# Altium schematic sheet Sheet1.SchDoc
size A2
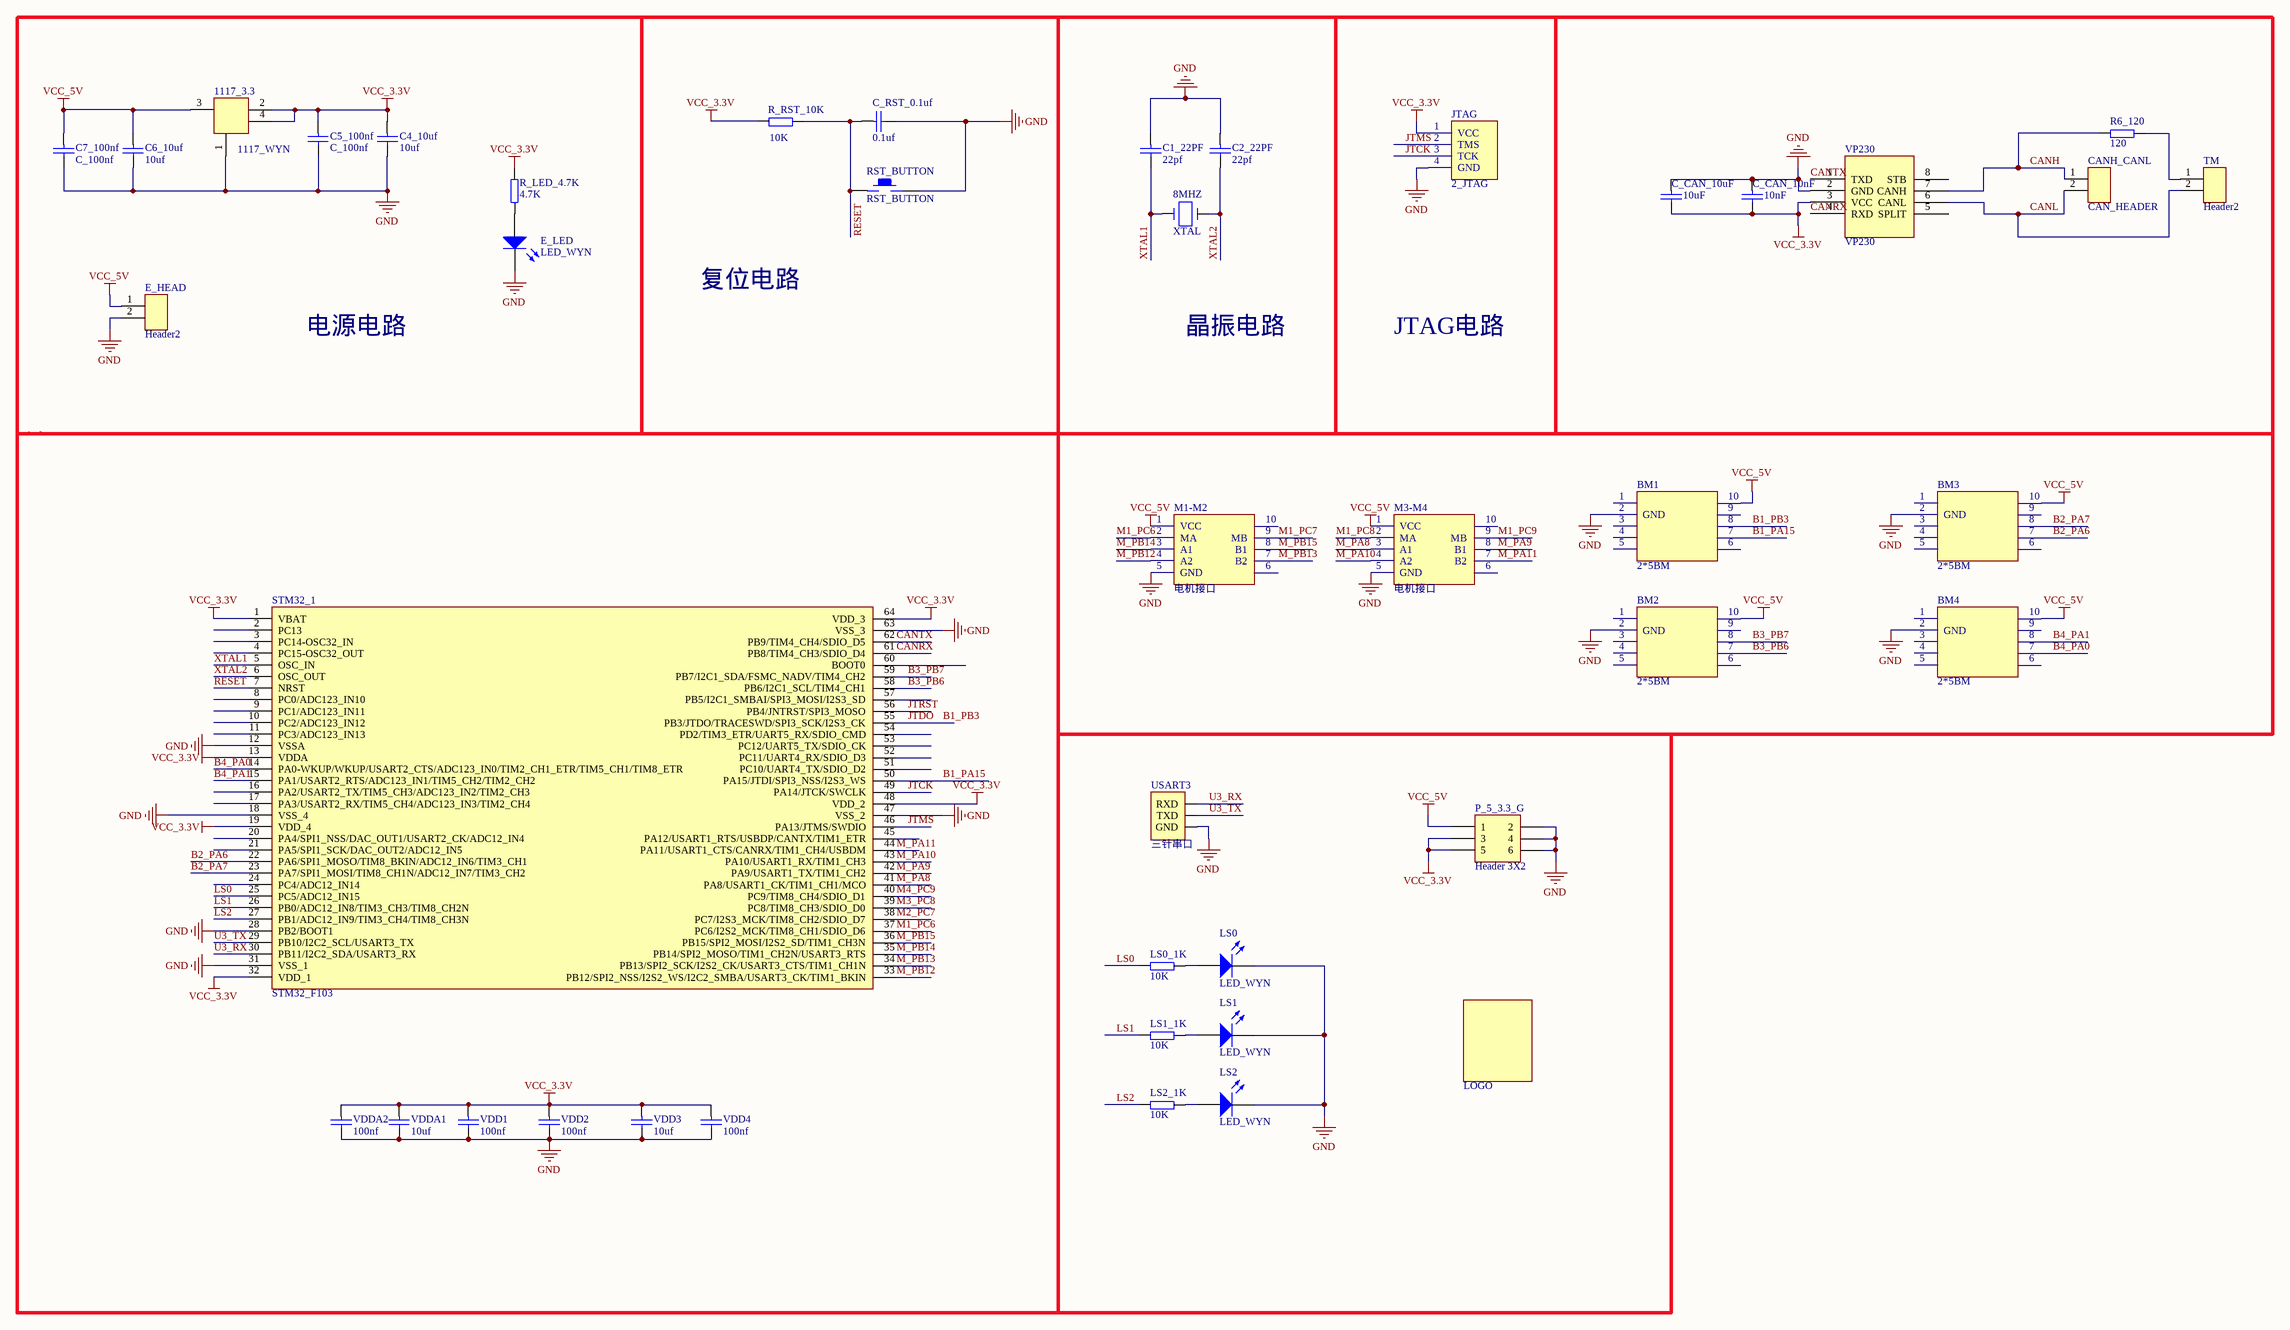
[diagram p0: Sheet1.SchDoc]

## Parts
8MHZ  XTAL  [XTAL_D]
1117_3.3  1117_WYN  [SOT-223_WYN]
?  LOGO  [LOGO]
BM1  2*5BM  [JTAG_10to20]
BM2  2*5BM  [JTAG_10to20]
BM3  2*5BM  [JTAG_10to20]
BM4  2*5BM  [JTAG_10to20]
C1_22PF  22pf  [0603_WYH]
C2_22PF  22pf  [0603_WYH]
C4_10uf  10uf  [0603_WYH]
C5_100nf  C_100nf  [0603_WYH]
C6_10uf  10uf  [0603_WYH]
C7_100nf  C_100nf  [0603_WYH]
C_CAN_10nF  10nF  [0603_WYH]
C_CAN_10uF  10uF  [0603_WYH]
C_RST_0.1uf  0.1uf  [0603_WYH]
CANH_CANL  CAN_HEADER
E_HEAD  Header2
E_LED  LED_WYN  [极性0805_WYN]
JTAG  2_JTAG  [HDR1X5]
LS0  LED_WYN  [极性0805_WYN]
LS0_1K  10K  [0603P]
LS1  LED_WYN  [极性0805_WYN]
LS1_1K  10K  [0603P]
LS2  LED_WYN  [极性0805_WYN]
LS2_1K  10K  [0603P]
M1-M2  电机接口  [JTAG_10to20]
M3-M4  电机接口  [JTAG_10to20]
P_5_3.3_G  Header 3X2  [HDR2X3]
R6_120  120  [0603P]
R_LED_4.7K  4.7K  [0805_WYN]
R_RST_10K  10K  [0603P]
RST_BUTTON  RST_BUTTON  [CLCK]
STM32_1  STM32_F103  [STM32TSQFP50P1200X1200X160-64N]
TM  Header2  [HDR1X2]
USART3  三针串口  [HDR1X3]
VDD1  100nf  [0603_WYH]
VDD2  100nf  [0603_WYH]
VDD3  10uf  [0603_WYH]
VDD4  100nf  [0603_WYH]
VDDA1  10uf  [0603_WYH]
VDDA2  100nf  [0603_WYH]
VP230  VP230  [VP230]

## Nets
GND: 1117_3.3.1 BM1.2(GND) BM2.2(GND) BM3.2(GND) BM4.2(GND) C1_22PF.1 C2_22PF.1 C4_10uf.2 C5_100nf.2 C6_10uf.2 C7_100nf.2 C_CAN_10nF.1 C_CAN_10uF.1 C_RST_0.1uf.2 E_HEAD.2 E_LED.2(K) JTAG.4(GND) LS0.2(K) LS1.2(K) LS2.2(K) M1-M2.5(GND) M3-M4.5(GND) P_5_3.3_G.2 P_5_3.3_G.4 P_5_3.3_G.6 RST_BUTTON.2 STM32_1.12(VSSA) STM32_1.18(VSS_4) STM32_1.28(PB2/BOOT1) STM32_1.31(VSS_1) STM32_1.47(VSS_2) STM32_1.63(VSS_3) USART3.3(GND) VDD1.2 VDD2.2 VDD3.2 VDD4.2 VDDA1.2 VDDA2.2 VP230.2(GND)
VCC_3.3V: 1117_3.3.2 1117_3.3.4 C4_10uf.1 C5_100nf.1 C_CAN_10nF.2 C_CAN_10uF.2 JTAG.1(VCC) P_5_3.3_G.3 P_5_3.3_G.5 R_LED_4.7K.2 R_RST_10K.1 STM32_1.1(VBAT) STM32_1.13(VDDA) STM32_1.19(VDD_4) STM32_1.32(VDD_1) STM32_1.48(VDD_2) STM32_1.64(VDD_3) VDD1.1 VDD2.1 VDD3.1 VDD4.1 VDDA1.1 VDDA2.1 VP230.3(VCC)
VCC_5V: 1117_3.3.3 BM1.10 BM2.10 BM3.10 BM4.10 C6_10uf.1 C7_100nf.1 E_HEAD.1 M1-M2.1(VCC) M3-M4.1(VCC) P_5_3.3_G.1
B1_PA15: BM1.7 STM32_1.50(PA15/JTDI/SPI3_NSS/I2S3_WS)
B1_PB3: BM1.8 STM32_1.55(PB3/JTDO/TRACESWD/SPI3_SCK/I2S3_CK)  [also labelled JTDO]
B2_PA6: BM3.7 STM32_1.22(PA6/SPI1_MOSO/TIM8_BKIN/ADC12_IN6/TIM3_CH1)
B2_PA7: BM3.8 STM32_1.23(PA7/SPI1_MOSI/TIM8_CH1N/ADC12_IN7/TIM3_CH2)
B3_PB6: BM2.7 STM32_1.58(PB6/I2C1_SCL/TIM4_CH1)
B3_PB7: BM2.8 STM32_1.59(PB7/I2C1_SDA/FSMC_NADV/TIM4_CH2)
B4_PA0: BM4.7 STM32_1.14(PA0-WKUP/WKUP/USART2_CTS/ADC123_IN0/TIM2_CH1_ETR/TIM5_CH1/TIM8_ETR)
B4_PA1: BM4.8 STM32_1.15(PA1/USART2_RTS/ADC123_IN1/TIM5_CH2/TIM2_CH2)
CANH: CANH_CANL.1 R6_120.1 VP230.7(CANH)
CANL: CANH_CANL.2 TM.2 VP230.6(CANL)
CANRX: STM32_1.61(PB8/TIM4_CH3/SDIO_D4) VP230.4(RXD)
CANTX: STM32_1.62(PB9/TIM4_CH4/SDIO_D5) VP230.1(TXD)
JTCK: JTAG.3(TCK) STM32_1.49(PA14/JTCK/SWCLK)
JTMS: JTAG.2(TMS) STM32_1.46(PA13/JTMS/SWDIO)
JTRST: STM32_1.56(PB4/JNTRST/SPI3_MOSO)
LS0: LS0_1K.1 STM32_1.25(PC5/ADC12_IN15)
LS1: LS1_1K.1 STM32_1.26(PB0/ADC12_IN8/TIM3_CH3/TIM8_CH2N)
LS2: LS2_1K.1 STM32_1.27(PB1/ADC12_IN9/TIM3_CH4/TIM8_CH3N)
M1_PC6: M1-M2.2(MA) STM32_1.37(PC6/I2S2_MCK/TIM8_CH1/SDIO_D6)
M1_PC7: M1-M2.9(MB)
M1_PC8: M3-M4.2(MA)
M1_PC9: M3-M4.9(MB)
M2_PC7: STM32_1.38(PC7/I2S3_MCK/TIM8_CH2/SDIO_D7)
M3_PC8: STM32_1.39(PC8/TIM8_CH3/SDIO_D0)
M4_PC9: STM32_1.40(PC9/TIM8_CH4/SDIO_D1)
M_PA8: M3-M4.3(A1) STM32_1.41(PA8/USART1_CK/TIM1_CH1/MCO)
M_PA9: M3-M4.8(B1) STM32_1.42(PA9/USART1_TX/TIM1_CH2)
M_PA10: M3-M4.4(A2) STM32_1.43(PA10/USART1_RX/TIM1_CH3)
M_PA11: M3-M4.7(B2) STM32_1.44(PA11/USART1_CTS/CANRX/TIM1_CH4/USBDM)
M_PB12: M1-M2.4(A2) STM32_1.33(PB12/SPI2_NSS/I2S2_WS/I2C2_SMBA/USART3_CK/TIM1_BKIN)
M_PB13: M1-M2.7(B2) STM32_1.34(PB13/SPI2_SCK/I2S2_CK/USART3_CTS/TIM1_CH1N)
M_PB14: M1-M2.3(A1) STM32_1.35(PB14/SPI2_MOSO/TIM1_CH2N/USART3_RTS)
M_PB15: M1-M2.8(B1) STM32_1.36(PB15/SPI2_MOSI/I2S2_SD/TIM1_CH3N)
RESET: C_RST_0.1uf.1 R_RST_10K.2 RST_BUTTON.1 STM32_1.7(NRST)
U3_RX: STM32_1.30(PB11/I2C2_SDA/USART3_RX) USART3.1(RXD)
U3_TX: STM32_1.29(PB10/I2C2_SCL/USART3_TX) USART3.2(TXD)
XTAL1: 8MHZ.1 C1_22PF.2 STM32_1.5(OSC_IN)
XTAL2: 8MHZ.2 C2_22PF.2 STM32_1.6(OSC_OUT)
NetE_LED_1: E_LED.1(A) R_LED_4.7K.1
NetLS0_1: LS0.1(A) LS0_1K.2
NetLS1_1: LS1.1(A) LS1_1K.2
NetLS2_1: LS2.1(A) LS2_1K.2
NetR6_120_2: R6_120.2 TM.1

Not connected (* = marked no-connect by the designer): BM1 1 3 4 5 6 9; BM2 1 3 4 5 6 9; BM3 1 3 4 5 6 9; BM4 1 3 4 5 6 9; M1-M2 6 10; M3-M4 6 10; STM32_1 2(PC13) 3(PC14-OSC32_IN) 4(PC15-OSC32_OUT) 8(PC0/ADC123_IN10) 9(PC1/ADC123_IN11) 10(PC2/ADC123_IN12) 11(PC3/ADC123_IN13) 16(PA2/USART2_TX/TIM5_CH3/ADC123_IN2/TIM2_CH3) 17(PA3/USART2_RX/TIM5_CH4/ADC123_IN3/TIM2_CH4) 20(PA4/SPI1_NSS/DAC_OUT1/USART2_CK/ADC12_IN4) 21(PA5/SPI1_SCK/DAC_OUT2/ADC12_IN5) 24(PC4/ADC12_IN14) 45(PA12/USART1_RTS/USBDP/CANTX/TIM1_ETR) 51(PC10/UART4_TX/SDIO_D2) 52(PC11/UART4_RX/SDIO_D3) 53(PC12/UART5_TX/SDIO_CK) 54(PD2/TIM3_ETR/UART5_RX/SDIO_CMD) 57(PB5/I2C1_SMBAI/SPI3_MOSI/I2S3_SD) 60(BOOT0); VP230 5(SPLIT) 8(STB)

## Notes on the sheet
- 复位电路
- 电源电路
- 晶振电路
- JTAG电路

## Library data of the parts
C1_22PF C2_22PF C4_10uf C5_100nf C6_10uf C7_100nf C_CAN_10nF C_CAN_10uF C_RST_0.1uf VDD1-VDD4 VDDA1 VDDA2 = CAP_WYN
LS0_1K LS1_1K LS2_1K R6_120 R_RST_10K = R
P_5_3.3_G = Header 3X2: Header, 3-Pin, Dual row; LatestRevisionDate: 17-Jul-2002; LatestRevisionNote: Re-released for DXP Platform.; Publisher: Altium Limited
R_LED_4.7K = RES_WYN